# EAGLE design Voltage_current_DAQ (EAGLE 6.2)
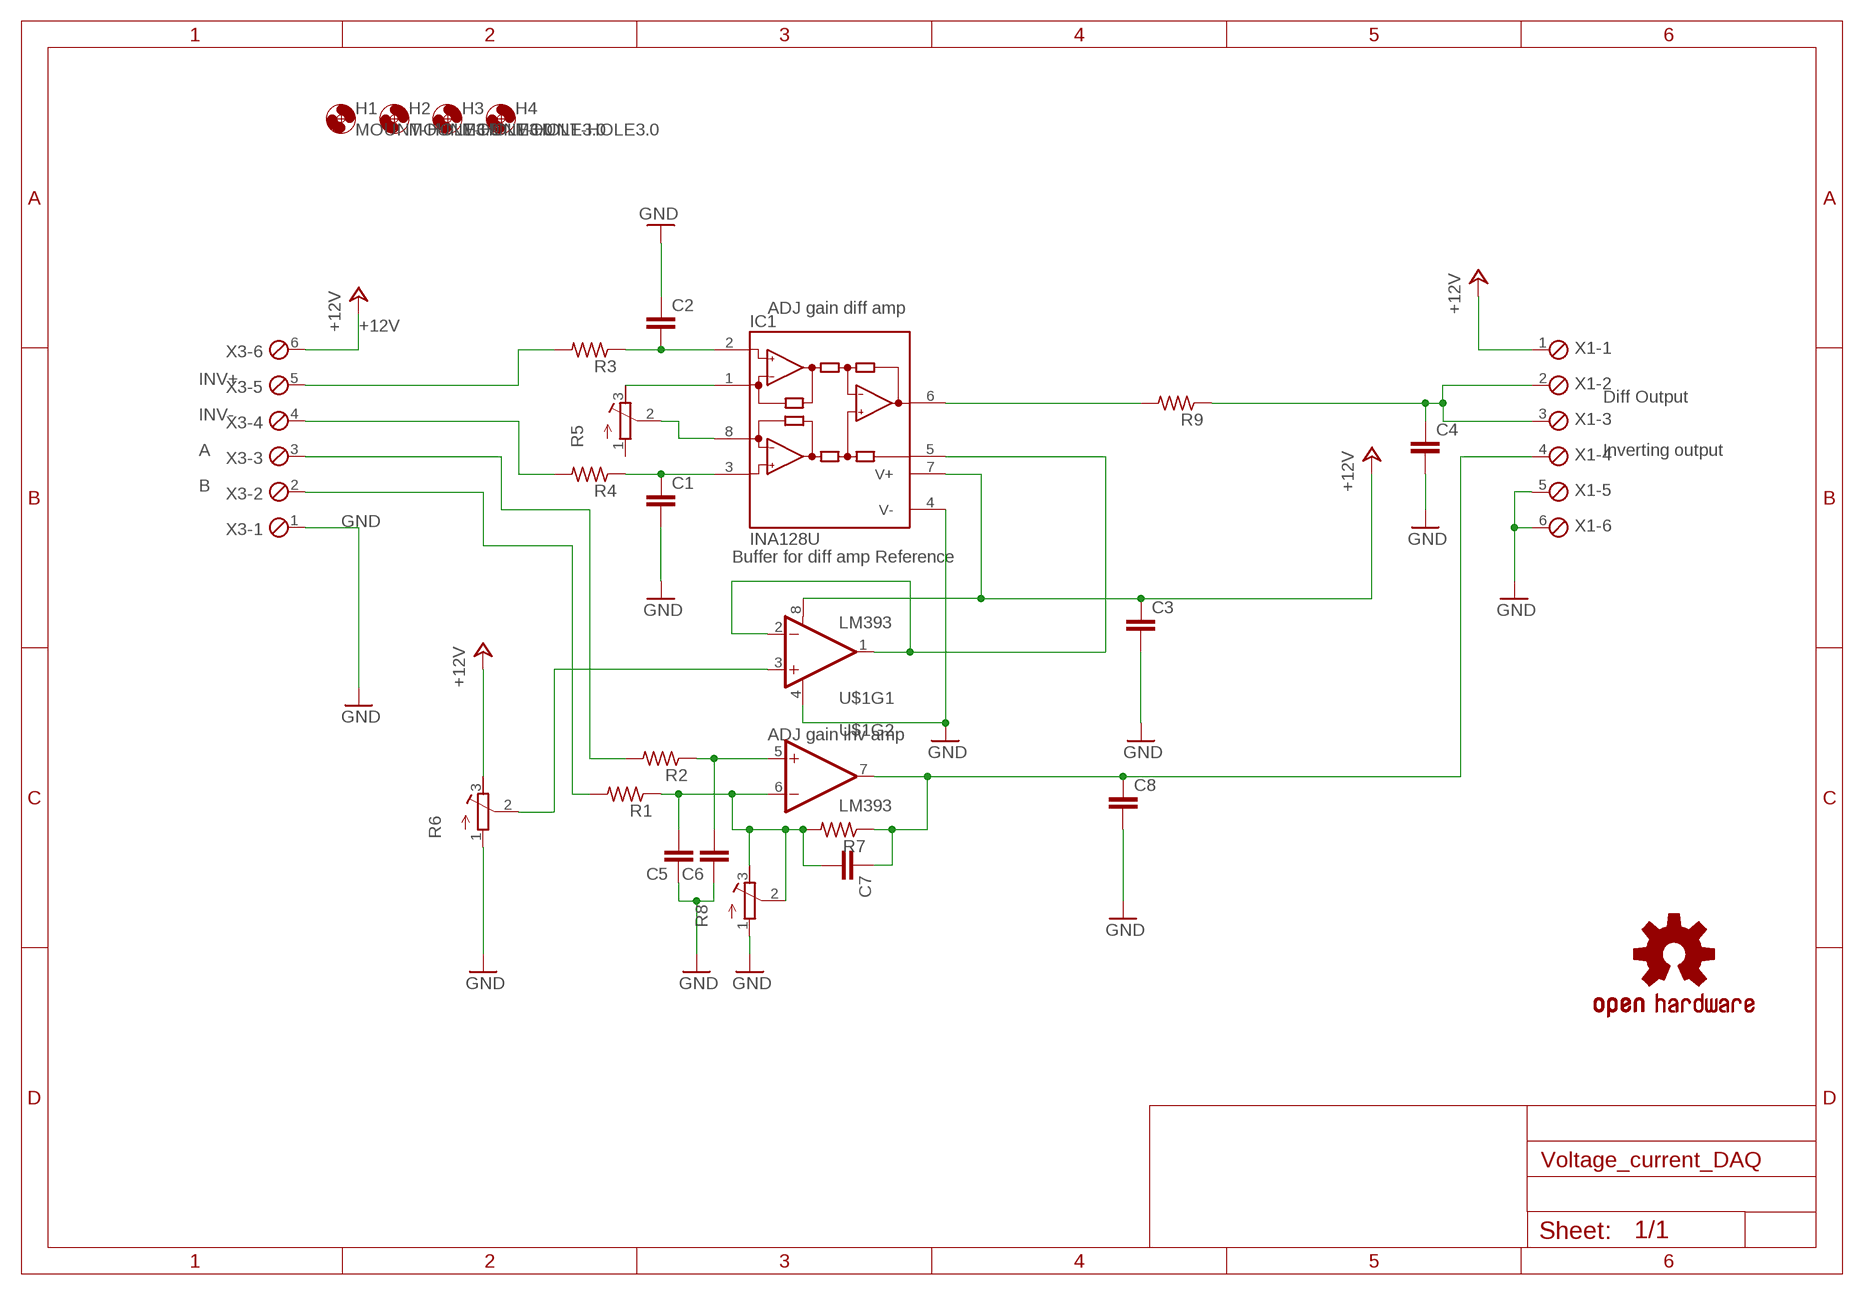
[diagram p0: schematic, sheet 1]

## Parts
C1  C-EUC0805  [C0805]
C2  C-EUC0805  [C0805]
C3  C-EUC0805  [C0805]
C4  C-EUC0805  [C0805]
C5  C-EUC0805  [C0805]
C6  C-EUC0805  [C0805]
C7  C-EUC0805  [C0805]
C8  C-EUC0805  [C0805]
H1  MOUNT-HOLE3.0  [3,0]
H2  MOUNT-HOLE3.0  [3,0]
H3  MOUNT-HOLE3.0  [3,0]
H4  MOUNT-HOLE3.0  [3,0]
IC1  INA128U  [SO08]
LOGO1  OSHW-LOGOL  [OSHW-LOGO-L]
R1  R-US_R0805  [R0805]
R2  R-US_R0603  [R0603]
R3  R-US_R0805  [R0805]
R4  R-US_R0805  [R0805]
R5  R-TRIMM64Y  [RTRIM64Y]
R6  R-TRIMM64Y  [RTRIM64Y]
R7  R-US_R0805  [R0805]
R8  R-TRIMM64Y  [RTRIM64Y]
R9  R-US_R0805  [R0805]
U$1  LM393  [SO08]
X1  MPT6  [6POL254]
X3  MPT6  [6POL254]

## Nets
+12V: C3.1 IC1.7(V+) U$1.8(V+) X1.1 X3.6
+24V: R6.3(E) ; supply symbol labelled +12V
GND: C1.2 C2.1 C3.2 C4.2 C5.1 C6.1 C8.2 IC1.4(V-) R6.1(A) R8.1(A) U$1.4(V-) X1.5 X1.6 X3.1
N$1: C2.2 IC1.2(-IN) R3.1
N$2: C1.1 IC1.3(+IN) R4.1
N$3: IC1.1(RG) R5.3(E)
N$4: IC1.8(RG) R5.2(S)
N$5: R3.2 X3.5
N$6: IC1.6(OUT) R9.2
N$7: R4.2 X3.4
N$8: C4.1 R9.1 X1.2 X1.3
N$9: R6.2(S) U$1.3(+IN)
N$10: IC1.5(REF) U$1.1(OUT) U$1.2(-IN)
N$11: C6.2 R2.1 U$1.5(+IN)
N$12: R1.2 X3.2
N$13: C5.2 C7.2 R1.1 R7.2 R8.2(S) R8.3(E) U$1.6(-IN)
N$14: C7.1 C8.1 R7.1 U$1.7(OUT) X1.4
N$15: R2.2 X3.3
Unconnected: R5.1(A)

## Notes on the sheet
- ADJ gain diff amp
- INV+
- Diff Output
- INV-
- A | Inverting output
- B
- Buffer for diff amp Reference
- ADJ gain inv amp

## Library data of the parts
C1-C8 = rcl:C-EU: CAPACITOR, European symbol
H1-H4 = holes:MOUNT-HOLE: MOUNTING HOLE with drill center marker
IC1 = burr-brown:INA128: Instrumentation Amplifiers Precision, Low Power; MF: TEXAS INSTRUMENTS; MPN: INA128U; OC_FARNELL: 1212413; OC_NEWARK: 35C1729
LOGO1 = SparkFun-Aesthetics:OSHW-LOGO: Open Source Hardware Logo This logo indicates the piece of hardware it is found on incorporates a OSHW license and/or adheres to the definition of open source hardware found here: http://freedomdefined.org/OSHW
R1-R4 R7 R9 = rcl:R-US_: RESISTOR, American symbol
R5 R6 R8 = rcl:R-TRIMM: Trimm resistor
U$1 = SparkFun-AnalogIC:LM393: Low-voltage comparator
X1 X3 = con-phoenix-254:MPT6: PHOENIX CONNECTOR; OC_FARNELL: unknown; OC_NEWARK: unknown

## Board
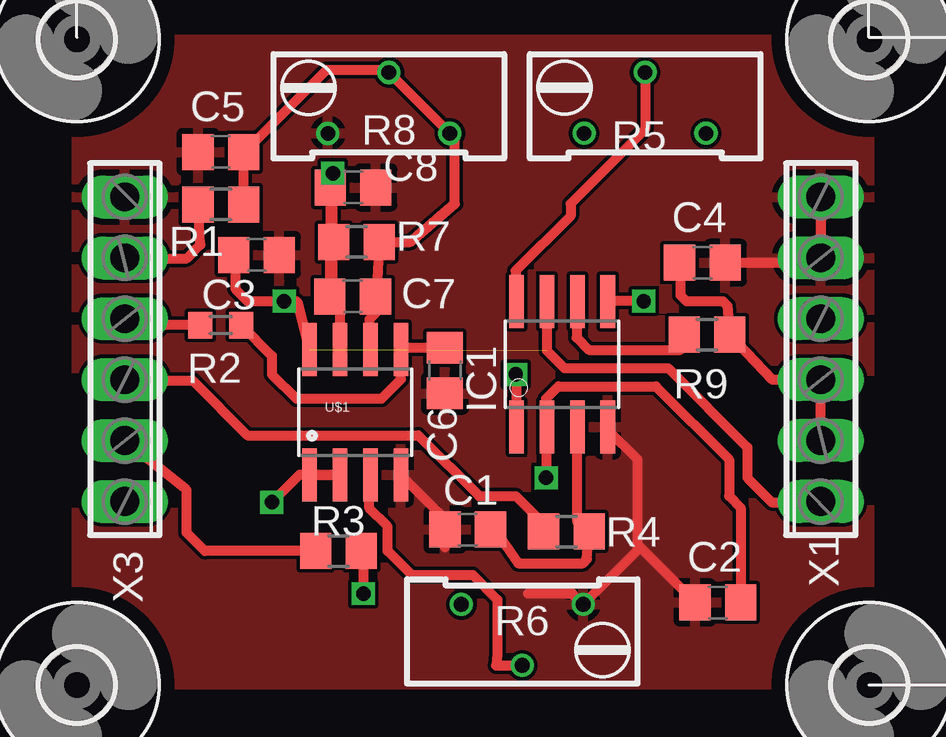
[diagram p1: board, top side]
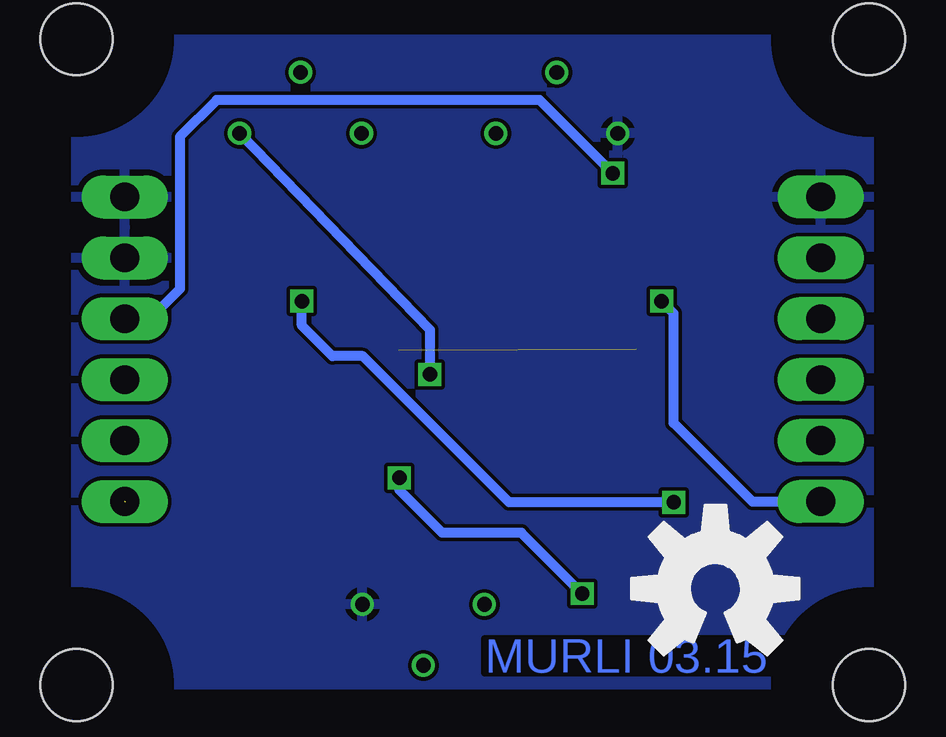
[diagram p2: board, bottom side, seen from below]

No outline drawn. Coordinates in mm, seen from the top.
Copper layers (1*16): Top 0.0356mm / dielectric 1.5011mm / Bottom 0.0356mm
Design rules: minimum track width 6mil, minimum drill 13mil, track to track 6mil, track to pad 6mil, pad to pad 6mil, via to via 6mil, smd to smd 6mil, copper to edge 15mil, drill to drill 6mil, minimum pad ring 7mil, minimum via ring 7mil, stop-mask expansion 3mil, vias tented up to drill 0mil, thermal gap 10mil

### Footprints (pad centres in the part's own frame; a part is rotated, then mirrored left to right if it is on the bottom)
C0805 = smd 1.3 x 1.5: 1 -0.95,0; 2 0.95,0
3,0 = hole 3: 0,0
SO08 = smd 0.61 x 2.21: 1 -1.905,-2.616; 2 -0.635,-2.616; 3 0.635,-2.616; 4 1.905,-2.616; 5 1.905,2.616; 6 0.635,2.616; 7 -0.635,2.616; 8 -1.905,2.616
R0805 = smd 1.3 x 1.5: 1 -0.95,0; 2 0.95,0
R0603 = smd 1 x 1.1: 1 -0.85,0; 2 0.85,0
RTRIM64Y = drill 0.61: 1 0,-2.54; 2 -2.54,0; 3 0,2.54
6POL254 = drill 1.2 pad 1.778 long: 1 -6.35,0; 2 -3.81,0; 3 -1.27,0; 4 1.27,0; 5 3.81,0; 6 6.35,0

### Placement (x,y rotation side)
C1  16.29,6.48 180 top
C2  26.71,3.44 0 top
C3  7.49,17.93 0 top
C4  26.07,17.6 0 top
C5  6,22.22 0 top
C6  15.34,13.11 90 top
C7  11.49,16.21 0 top
C8  11.51,20.75 0 top
H1  0,26.92 0 top
H2  33.02,26.92 0 top
H3  33.02,0 0 top
H4  0,0 0 top
IC1  20.22,13.38 0 top
LOGO1  6.39,4.02 0 bottom
R1  6,20.03 180 top
R2  6,15 180 top
R3  10.91,5.59 180 top
R4  20.4,6.4 180 top
R5  23.68,23 270 top
R6  18.56,3.36 90 top
R7  11.65,18.48 0 top
R8  13,23 270 top
R9  26.26,14.61 180 top
U$1  11.6,11.38 0 top
X1  31,14 90 top
X3  2,14 270 top

### Tracks (layer width: path | path; a pad name or v marks a point on that pad's centre or on a via)
+12V  (via drill 0.6)  (2 unrouted)
  Top 0.406: IC1.7 19.59,13.94 20.32,13.21 24.64,13.21 27.94,9.91 27.94,8.64 28.96,7.62 30.97,7.62 | 9.65,14.04 U$1.8 9.19,15.96 9.14,16 v8.64,16 7.11,16 6.6,16.51 6.6,17.87 C3.1
  Bottom 0.406: v8.64,16 8.13,15.49 8.13,10.92 4.86,7.65 X3.6
GND
  Top 0.406: C4.2 30.79,17.6 X1.5 X1.6 | U$1.4 15.34,6.93 C1.2 15.34,5.74 | C2.1 23.37,5.83 | 23.37,5.83 23.37,9.4 22.12,10.64 IC1.4 | 23.37,5.83 23.37,5.63 R6.1 20.65,3.81 18.8,3.81
  pour Top: 0,26.92 33.02,26.92 33.02,0 0,0
  pour Bottom: 0,26.92 0,0 33.02,0 33.02,26.92
N$1  (via drill 0.6)
  Top 0.406: C2.2 27.66,7.39 27.18,7.87 27.18,9.4 24.13,12.45 20.07,12.45 19.56,11.94 19.56,10.74 IC1.2 19.59,8.66 v19.56,8.64 | R3.1 11.94,5.41 v11.94,3.81
  Bottom 0.406: v11.94,3.81 14.48,6.35 17.78,6.35 19.56,8.13 v19.56,8.64
N$2
  Top 0.406: C1.1 17.27,6.7 18.39,5.08 21.08,5.08 21.25,5.25 R4.1 20.86,6.79 IC1.3
N$3  (via drill 0.6)
  Top 0.406: v18.29,12.95 18.32,12.93 IC1.1
  Bottom 0.406: R5.3 18.29,14.82 v18.29,12.95
N$4
  Top 0.406: R5.2 23.68,23.17 20.57,20.07 20.57,19.56 18.29,17.27 18.29,16.02 IC1.8
N$5
  Top 0.406: R3.2 5.33,5.59 4.57,6.35 4.57,8.13 X3.5
N$6
  Top 0.406: IC1.6 20.83,15.97 20.83,14.48 21.34,13.97 25.15,13.97 25.41,14.23 R9.2
N$7
  Top 0.406: X3.4 2.03,12.7 4.83,12.7 7.11,10.41 14.22,10.41 16.76,7.87 18.29,7.87 19.55,6.61 R4.2
N$8
  Top 0.406: 30.97,10.16 X1.2 X1.3 28.98,12.73 R9.1 27.11,15.82 26.92,16 25.4,16 25.15,16.26 25.15,17.57 C4.1
N$9
  Top 0.406: U$1.3 12.19,8.72 12.19,7.37 12.95,6.6 12.95,5.59 13.97,4.57 16.51,4.57 17.53,3.56 17.53,1.27 17.47,0.82 R6.2
N$10  (via drill 0.6)
  Top 0.406: U$1.1 U$1.2 9.27,8.76 v8.13,7.62 | v23.62,16 IC1.5
  Bottom 0.406: v8.13,7.62 14.99,7.62 21.08,13.72 22.35,13.72 23.62,14.99 v23.62,16
N$11
  Top 0.406: R2.1 8.13,13.72 8.13,12.95 9.14,11.94 12.7,11.94 13.51,12.74 U$1.5 13.57,14.06 C6.2
N$12
  Top 0.406: X3.2 2.03,17.78 4.57,17.78 5.15,18.36 R1.2
N$13
  Top 0.406: U$1.6 12.19,14.04 12.19,15.24 12.44,15.49 C7.2 12.5,16.52 R7.2 13.9,18.48 15.75,20.07 15.75,22.79 R8.3 R8.2 12.89,25.65 10.41,25.65 6.95,22.19 C5.2 R1.1
N$14  (via drill 0.6)
  Top 0.406: 10.92,14.04 U$1.7 10.96,16.04 10.67,16.33 | C8.1 10.56,18.46 R7.1 10.54,17.96 C7.1 10.67,16.33 | 10.67,16.33 v10.67,21.34
  Bottom 0.406: v10.67,21.34 13.72,24.38 27.18,24.38 28.7,22.86 28.7,16.51 29.94,15.27 X1.4
N$15
  Top 0.406: R2.2 2.27,15 X3.3

### Text on the board
Bottom: MURLI 03.15